# EAGLE design PR5008 (EAGLE 6.6.0)
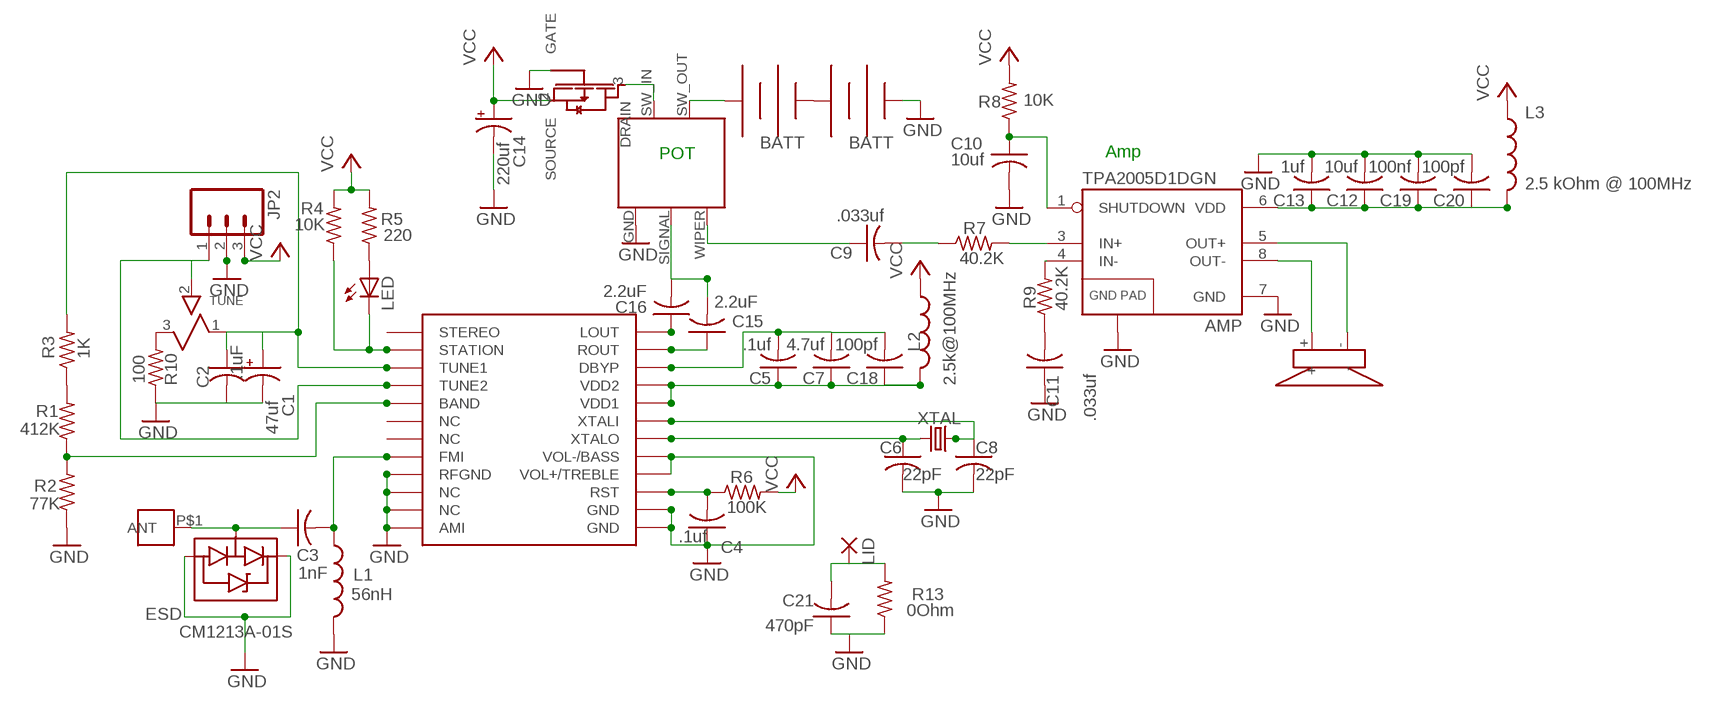
[diagram p0: schematic, sheet 1]

## Parts
AMP  TPA2005D1DGN  [POWER-SOP8]
ANT  M3_SCREW_POST  [M3_SCREW_POST]
C1  47uf  CPOL-USE2-5  [E2-5]
C2  .1uF  C-USC0603  [C0603]
C3  1nF  C-USC0603  [C0603]
C4  .1uf  C-USC0603  [C0603]
C5  .1uf  C-USC0603  [C0603]
C6  22pF  C-USC0603  [C0603]
C7  4.7uf  C-USC0603  [C0603]
C8  22pF  C-USC0603  [C0603]
C9  .033uf  C-USC0603  [C0603]
C10  10uf  C-USC0603  [C0603]
C11  .033uf  C-USC0603  [C0603]
C12  10uf  C-USC0603  [C0603]
C13  1uf  C-USC0603  [C0603]
C14  220uf  CPOL-USE2-5  [E2-5]
C15  2.2uF  C-USC0603  [C0603]
C16  2.2uF  C-USC0603  [C0603]
C18  100pf  C-USC0603  [C0603]
C19  100nf  C-USC0603  [C0603]
C20  100pf  C-USC0603  [C0603]
C21  470pF  C-USC0603  [C0603]
ESD  CM1213A-01S  [SOT23-3]
FET  SI2333DDS  [SI2333DDS]
JP2  M03LOCK  [1X03_LOCK]
L1  56nH  INDUCTOR0603  [0603]
L2  2.5k@100MHz  INDUCTOR0603  [0603]
L3  2.5 kOhm @ 100MHz  INDUCTOR0603  [0603]
LED  LEDCHIPLED_0805  [CHIPLED_0805]
LID  2,54/1,0  [2,54/1,0]
R1  412K  R-US_R0603  [R0603]
R2  77K  R-US_R0603  [R0603]
R3  1K  R-US_R0603  [R0603]
R4  10K  R-US_R0603  [R0603]
R5  220  R-US_R0603  [R0603]
R6  100K  R-US_R0603  [R0603]
R7  40.2K  R-US_R0603  [R0603]
R8  10K  R-US_R0603  [R0603]
R9  40.2K  R-US_R0603  [R0603]
R10  100  R-US_R0603  [R0603]
R13  0Ohm  R-US_R0603  [R0603]
TUNE  10k  64XR_BOURNS_TRIMPOT  [64XR_BOURNS_TRIMPOT]
U$1  BK-92_MPD_AA_BATT_CLIP  [BK-92_MPD_AA_BATT_CLIP]
U$2  BK-92_MPD_AA_BATT_CLIP  [BK-92_MPD_AA_BATT_CLIP]
U$3  CE32A_DAYTON_SPKR  [CE32A_DAYTON_SPKR]
U$4  SI4831_FM_IC  [SI4831_FM_IC]
U$5  RV170SF_TAIWANA_POT_SW  [RV170SF_TAIWANA_POT_SW]
XTAL  CRYSTAL32-SMD  [CRYSTAL-32KHZ-SMD]

## Nets
GND: AMP.7(GND) AMP.9(GND) C1.- C2.2 C4.1 C6.2 C8.2 C10.2 C11.1 C12.2 C13.2 C14.- C19.2 C20.2 C21.1 ESD.2(VP) ESD.3(VN) FET.1(GATE) JP2.2 L1.2 R2.1 R10.1 R13.1 U$2.NEG U$2.NEG@2(NEG) U$4.AMI U$4.GND U$4.GND@2(GND) U$4.NC@3(NC) U$4.NC@4(NC) U$4.RFGND U$4.VOL+/TREBLE U$4.VOL-/BASS U$5.GND
N$1: AMP.3(IN+) R7.2
N$2: AMP.4(IN-) R9.2
N$3: C11.2 R9.1
N$4: C9.2 R7.1
N$5: C15.2 C16.2 U$5.SIGNAL
N$6: C5.2 C7.2 C18.2 U$4.DBYP
N$7: C8.1 U$4.XTALI XTAL.X1
N$8: C4.2 R6.1 U$4.RST
N$9: LED.C R4.1 U$4.STATION
N$10: C6.1 U$4.XTALO XTAL.X2
N$11: LED.A R5.1
N$12: JP2.1 TUNE.2 U$4.TUNE2
N$13: R1.1 R2.2 U$4.BAND
N$14: U$1.NEG U$1.NEG@2(NEG) U$2.POS U$2.POS@2(POS)
N$15: C3.2 L1.1 U$4.FMI
N$16: C5.1 C7.1 C18.1 L2.2 U$4.VDD1 U$4.VDD2
N$17: AMP.6(VDD) C12.1 C13.1 C19.1 C20.1 L3.2
N$18: AMP.1(SHUTDOWN) C10.1 R8.1
N$19: ANT.P$1(ANT) C3.1 ESD.1(CH)
N$20: R1.2 R3.1
N$21: U$1.POS U$1.POS@2(POS) U$5.SW_OUT
N$22: C1.+ C2.1 R3.2 TUNE.1 U$4.TUNE1
N$23: AMP.5(OUT+) U$3.-
N$24: AMP.8(OUT-) U$3.+
N$25: C9.1 U$5.WIPER
N$29: R10.2 TUNE.3
N$30: FET.3(DRAIN) U$5.SW_IN
N$31: C15.1 U$4.ROUT
N$32: C21.2 LID.1(P) R13.2
N$33: C16.1 U$4.LOUT
VCC: C14.+ FET.2(SOURCE) JP2.3 L2.1 L3.1 R4.2 R5.2 R6.2 R8.2
Unconnected: U$4.NC U$4.NC@2(NC) U$4.STEREO

## Notes on the sheet
- POT | Amp

## Library data of the parts
AMP = SparkFun-AnalogIC:TPA2005D1: 1.4W MONO CLASS-D AUDIO POWER AMPLIFIER The TPA2005D1 is a 1.4-W high efficiency filter-free class-D audio power amplifier in a BGA, QFN, or MSOP package that requires only three external components. Datasheet: http://focus.ti.com/lit/ds/symlink/tpa2005d1.pdf 1.4 W Into 8 ? From a 5V Supply at THD = 10% (Typ) Maximum Battery Life and Minimum Heat Efficiency With an 8-? Speaker: 84% at 400 mW, 79% at 100 mW 2.8-mA Quiescent Current 0.5-mA Shutdown Current Ideal for Wireless or Cellular Handsets and PDAs Capable of Driving an 8-? Speaker (2.5 V ? VDD ? 5.5 V) and a 4-? Speaker (2.5 V ? VDD ? 4.2 V) Only Three External Components Optimized PWM Output Stage Eliminates LC Output Filter Internally Generated 250-kHz Switching Frequency Eliminates Capacitor and Resistor Improved PSRR (-71 dB at 217 Hz) and Wide Supply Voltage (2.5 V to 5.5 V) Eliminates Need for a Voltage Regulator Fully Differential Design Reduces RF Rectification and Eliminates Bypass Capacitor Improved CMRR Eliminates Two Input Coupling Capacitors
ANT = PR_Libraries:M3_SCREW_POST
C1 C14 = CPOL-US-LongPads :CPOL-US: POLARIZED CAPACITOR, American symbol
C2-C13 C15 C16 C18-C21 = resistor:C-US: CAPACITOR, American symbol
ESD = PubRadioLib:CM1213A-01S: ESD protection
FET = PubRadioLib:SI2333DDS
JP2 = SparkFun-Connectors:M03: Header 3 Standard 3-pin 0.1" header. Use with straight break away headers (SKU : PRT-00116), right angle break away headers (PRT-00553), swiss pins (PRT-00743), machine pins (PRT-00117), and female headers (PRT-00115). Molex polarized connector foot print use with SKU : PRT-08232 with associated crimp pins and housings.
L1-L3 = SparkFun-Passives:INDUCTOR: Inductors Basic Inductor/Choke - 0603 and 1206. Footprints are not proven and vary greatly between part numbers. SRN6045- 33uH, 20% 1.4A SDR0403-560KL - 56uH, 10%, 500mA RMS/740mA peak
LED = led:LED: LED OSRAM: - CHIPLED LG R971, LG N971, LY N971, LG Q971, LY Q971, LO R971, LY R971 LH N974, LH R974 LS Q976, LO Q976, LY Q976 LO Q996 - Hyper CHIPLED LW Q18S LB Q993, LB Q99A, LB R99A - SideLED LS A670, LO A670, LY A670, LG A670, LP A670 LB A673, LV A673, LT A673, LW A673 LH A674 LY A675 LS A676, LA A676, LO A676, LY A676, LW A676 LS A679, LY A679, LG A679 - Hyper Micro SIDELED® LS Y876, LA Y876, LO Y876, LY Y876 LT Y87S - SmartLED LW L88C, LW L88S LB L89C, LB L89S, LG L890 LS L89K, LO L89K, LY L89K LS L896, LA L896, LO L896, LY L896 - TOPLED LS T670, LO T670, LY T670, LG T670, LP T670 LSG T670, LSP T670, LSY T670, LOP T670, LYG T670 LG T671, LOG T671, LSG T671 LB T673, LV T673, LT T673, LW T673 LH T674 LS T676, LA T676, LO T676, LY T676, LB T676, LH T676, LSB T676, LW T676 LB T67C, LV T67C, LT T67C, LS T67K, LO T67K, LY T67K, LW E67C LS E67B, LA E67B, LO E67B, LY E67B, LB E67C, LV E67C, LT E67C LW T67C LS T679, LY T679, LG T679 LS T770, LO T770, LY T770, LG T770, LP T770 LB T773, LV T773, LT T773, LW T773 LH T774 LS E675, LA E675, LY E675, LS T675 LS T776, LA T776, LO T776, LY T776, LB T776 LHGB T686 LT T68C, LB T68C - Hyper Mini TOPLED® LB M676 - Mini TOPLED Santana® LG M470 LS M47K, LO M47K, LY M47K Source: http://www.osram.convergy.de LUXEON: - LUMILED® LXK2-PW12-R00, LXK2-PW12-S00, LXK2-PW14-U00, LXK2-PW14-V00 LXK2-PM12-R00, LXK2-PM12-S00, LXK2-PM14-U00 LXK2-PE12-Q00, LXK2-PE12-R00, LXK2-PE12-S00, LXK2-PE14-T00, LXK2-PE14-U00 LXK2-PB12-K00, LXK2-PB12-L00, LXK2-PB12-M00, LXK2-PB14-N00, LXK2-PB14-P00, LXK2-PB14-Q00 LXK2-PR12-L00, LXK2-PR12-M00, LXK2-PR14-Q00, LXK2-PR14-R00 LXK2-PD12-Q00, LXK2-PD12-R00, LXK2-PD12-S00 LXK2-PH12-R00, LXK2-PH12-S00 LXK2-PL12-P00, LXK2-PL12-Q00, LXK2-PL12-R00 Source: www.luxeon.com KINGBRIGHT: KA-3528ASYC Source: www.kingbright.com
LID = wirepad:2,54/1,0: THROUGH-HOLE PAD
R1-R10 R13 = resistor:R-US_: RESISTOR, American symbol
TUNE = PR_Libraries:64XR_BOURNS_TRIMPOT: This is a bourns trimpot
U$1 U$2 = PR_Libraries:BK-92_MPD_AA_BATT_CLIP
U$3 = PR_Libraries:CE32A_DAYTON_SPKR
U$4 = PR_Libraries:SI4831_FM_IC
U$5 = PR_Libraries:RV170SF_TAIWANA_POT_SW
XTAL = SparkFun-FreqCtrl:CRYSTAL: Various standard crystals. Proven footprints. Spark Fun Electronics SKU : COM-00534; PROD_ID: XTAL-07894

## Board
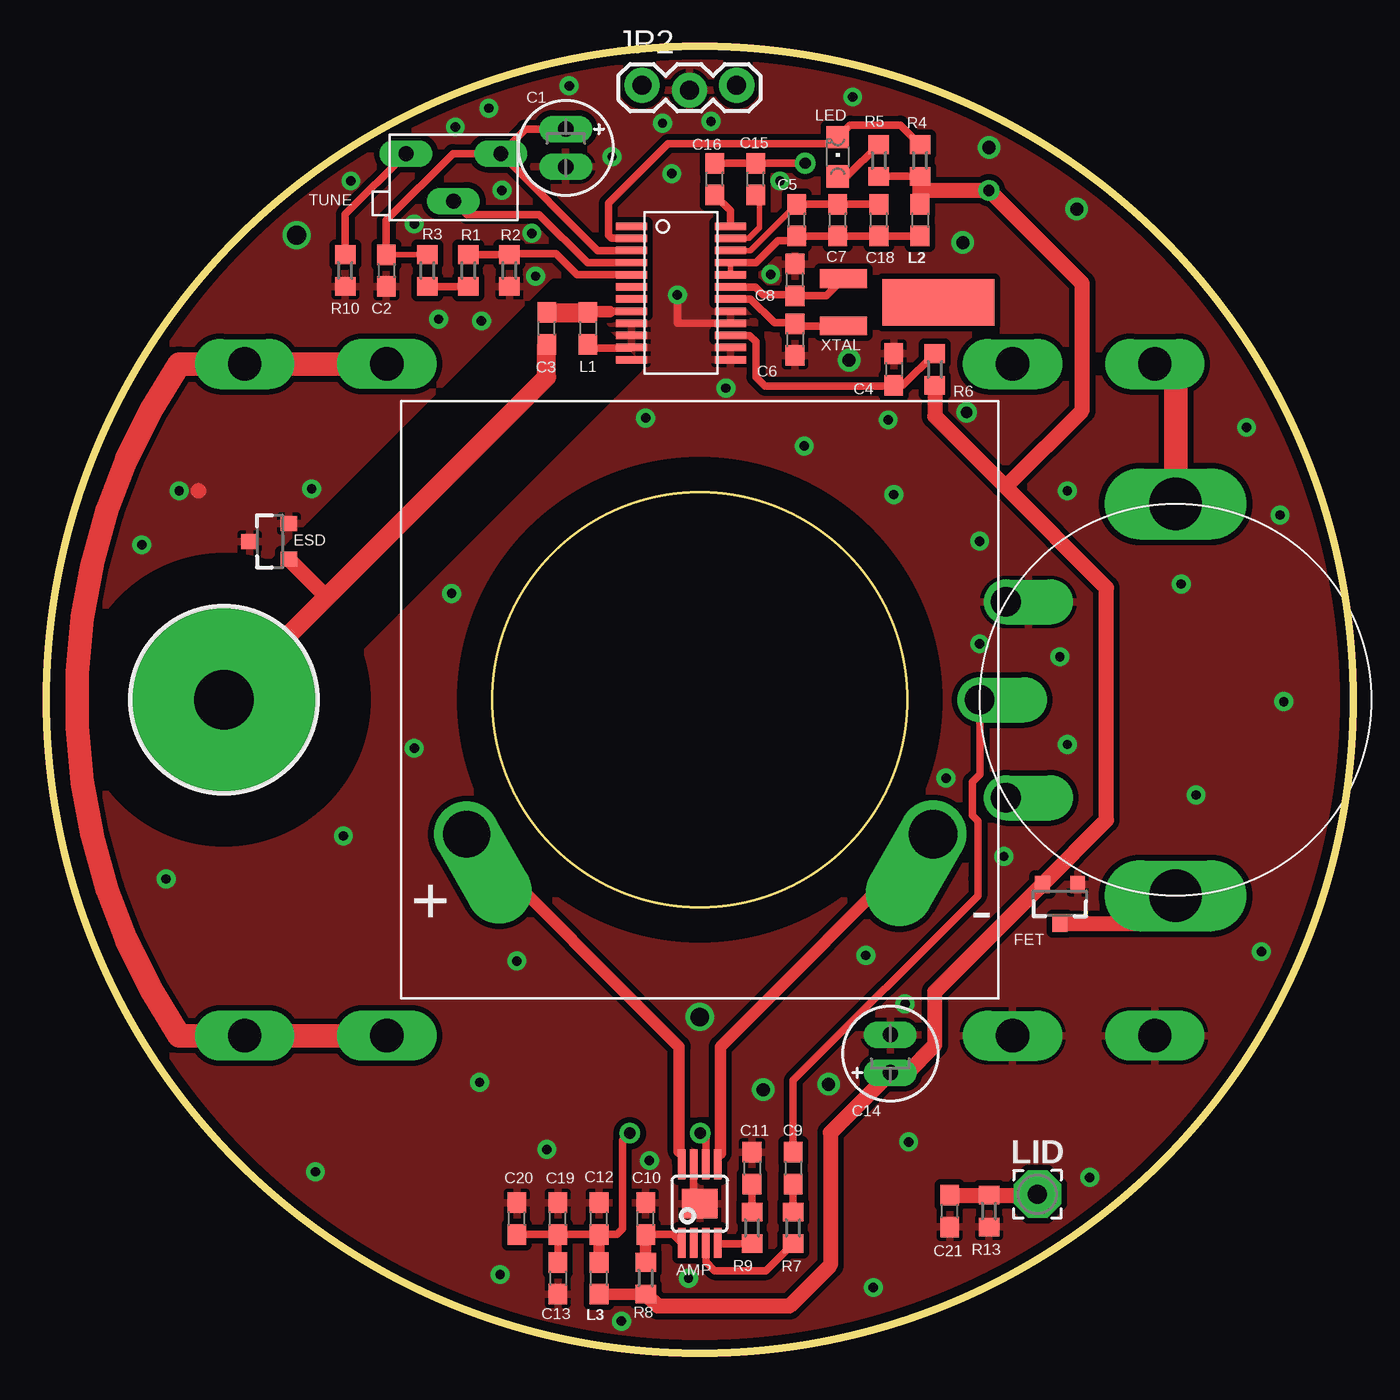
[diagram p1: board, top side]
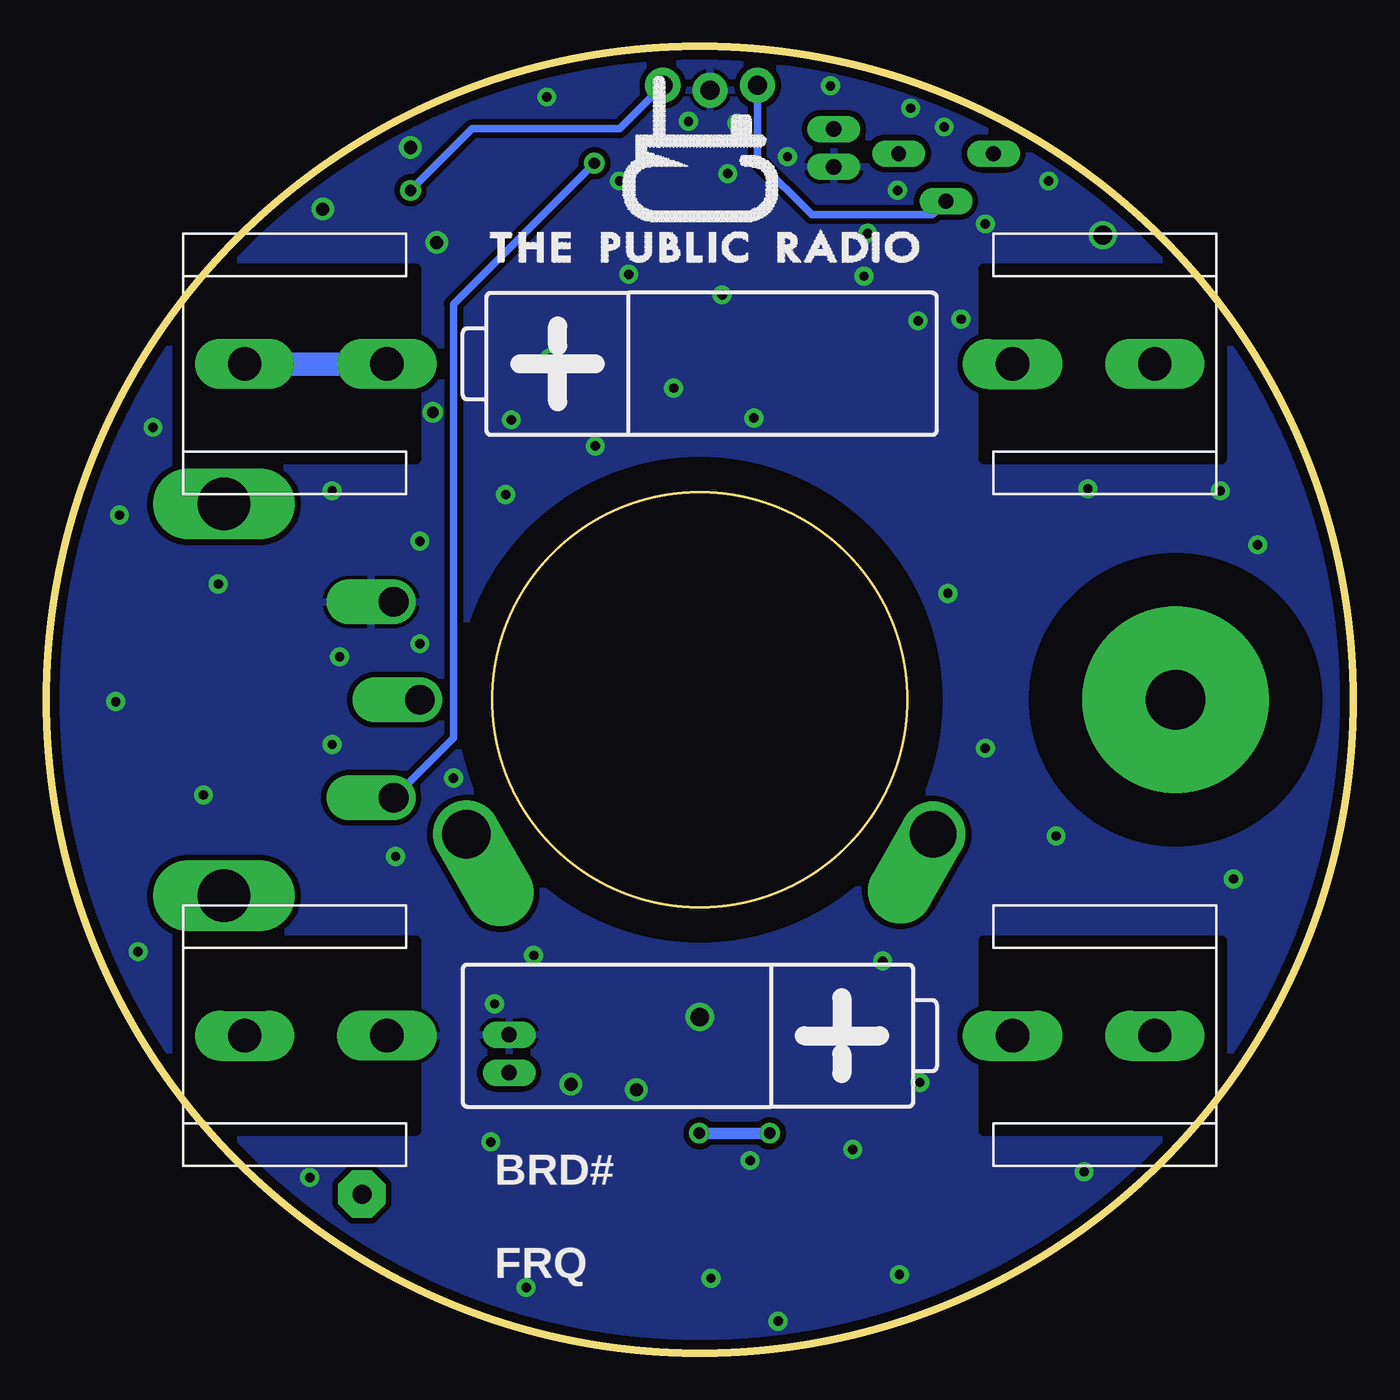
[diagram p2: board, bottom side, seen from below]

Size 70 x 70 mm. Coordinates in mm from the lower left corner, seen from the top.
Outline: circle at 35,35 radius 35
Copper layers (1*16): Top 0.035mm / dielectric 1.5mm / Bottom 0.035mm
Design rules "PCBCart-Standard *": minimum track width 8mil, minimum drill 0.4mm, track to track 8mil, track to pad 8mil, pad to pad 8mil, via to via 8mil, smd to smd 8mil, copper to edge 20mil, drill to drill 8mil, minimum pad ring 8mil, minimum via ring 10mil, stop-mask expansion 3mil, vias tented up to drill 0mil, thermal gap 8mil
tRestrict: area 22.5,22.5 to 47.5,47.5; area 5.2,30.8 to 31.7,57.3
bRestrict: area 22.5,22.5 to 47.5,47.5

### Footprints (pad centres in the part's own frame; a part is rotated, then mirrored left to right if it is on the bottom)
POWER-SOP8 = smd 0.4 x 1.6: 1 -0.975,-2.1; 2 -0.325,-2.1; 3 0.325,-2.1; 4 0.975,-2.1; 5 0.975,2.1; 6 0.325,2.1; 7 -0.325,2.1; 8 -0.975,2.1 | smd 1.89 x 1.57: 9 0,0
M3_SCREW_POST = drill 3.2 pad 10: P$1 0,0
E2-5 = drill 0.813 pad 1.422 long: + -1.016,0; - 1.016,0
C0603 = smd 1.1 x 1: 1 -0.85,0; 2 0.85,0
SOT23-3 = smd 0.8 x 0.9: 1 -0.95,-1; 2 0.95,-1; 3 0,1.1
SI2333DDS = smd 0.8 x 0.9: 1 -0.95,-1; 2 0.95,-1; 3 0,1.1
1X03_LOCK = drill 1.016 pad 1.88: 1 0,0.127; 2 2.54,-0.127; 3 5.08,0.127
0603 = smd 1.1 x 1: 1 -0.85,0; 2 0.85,0
CHIPLED_0805 = smd 1.2 x 1.2: A 0,-1.05; C 0,1.05
2,54/1,0 = drill 1.016 pad 2.54 octagon: 1 0,0
R0603 = smd 1 x 1.1: 1 -0.85,0; 2 0.85,0
64XR_BOURNS_TRIMPOT = drill 0.8 pad 1.422 long: 1 2.54,1.27; 2 0,-1.27; 3 -2.54,1.27
BK-92_MPD_AA_BATT_CLIP = drill 1.778 long: NEG -24.384,0; NEG@2 -16.764,0; POS 16.764,0; POS@2 24.384,0
CE32A_DAYTON_SPKR = drill 2.5 offset: + -12.5,-7.2 | drill 2.6 offset: - 12.5,-7.2
SI4831_FM_IC = smd 1.65 x 0.4: AMI -2.65,-3.575; BAND -2.65,0.975; DBYP 2.65,2.275; FMI -2.65,-0.975; GND 2.65,-2.925; GND@2 2.65,-3.575; LOUT 2.65,3.575; NC -2.65,0.325; NC@2 -2.65,-0.325; NC@3 -2.65,-2.275; NC@4 -2.65,-2.925; RFGND -2.65,-1.625; ROUT 2.65,2.925; RST 2.65,-2.275; STATION -2.65,2.925; STEREO -2.65,3.575; TUNE1 -2.65,2.275; TUNE2 -2.65,1.625; VDD1 2.65,0.975; VDD2 2.65,1.625; VOL+/TREBLE 2.65,-1.625; VOL-/BASS 2.65,-0.975; XTALI 2.65,0.325; XTALO 2.65,-0.325
RV170SF_TAIWANA_POT_SW = drill 1.6 offset: GND -5.25,-9.09; SIGNAL 5.25,-9.09; WIPER 0,-10.5 | drill 2.8 long: SW_IN 10.5,0; SW_OUT -10.5,0
CRYSTAL-32KHZ-SMD = smd 2.5 x 6: SHEILD 0,5.08 | smd 1 x 2.5: X1 -1.27,0; X2 1.27,0

### Placement (x,y rotation side)
AMP  35,8 0 top
ANT  9.5,35 0 top
C1  27.82,64.57 270 top
C2  18.2,58 270 top
C3  26.8,54.9 90 top
C4  45.4,52.7 270 top
C5  40.2,60.7 90 top
C6  40.1,54.3 270 top
C7  42.4,60.7 90 top
C8  40.1,57.5 90 top
C9  40,9.9 270 top
C10  32.1,7.2 90 top
C11  37.8,9.9 270 top
C12  29.6,7.2 90 top
C13  27.4,4 270 top
C14  45.22,16.03 90 top
C15  38,62.9 90 top
C16  35.8,62.9 90 top
C18  44.6,60.7 90 top
C19  27.4,7.2 90 top
C20  25.2,7.2 90 top
C21  48.4,7.6 90 top
ESD  11.98,43.49 90 top
FET  54.3,24.1 180 top
JP2  31.9,67.8 0 top
L1  29,54.9 270 top
L2  46.8,60.7 270 top
L3  29.6,4 90 top
LED  42.4,64.1 0 top
LID  53.1,8.5 0 top
R1  22.6,58 270 top
R2  24.8,58 90 top
R3  20.4,58 90 top
R4  46.8,63.9 270 top
R5  44.6,63.9 270 top
R6  47.6,52.7 270 top
R7  40,6.7 270 top
R8  32.1,4 270 top
R9  37.8,6.7 270 top
R10  16,58 90 top
R13  50.5,7.6 90 top
TUNE  21.8,63 0 top
U$1  35,53 180 bottom
U$2  35,17 0 bottom
U$3  35,35 0 top
U$4  34,56.8 0 top
U$5  60.5,35 270 top
XTAL  42.7,56.3 270 top

### Tracks (layer width: path | path; a pad name or v marks a point on that pad's centre or on a via)
GND  (via drill 0.5, 0.6, 0.7, 1)
  Top 0.406: L1.2 29.2,53.85 31.33,53.85 U$4.NC@4 | AMP.7 34.67,8.32 AMP.9 | U$4.VOL+/TREBLE 33.8,55.17 v33.8,56.7
  Top 0.813: 8.17,46.2 8.1,46.2
  other vias: 43,53.2 55.2,61.3 23.3,55.3 13.4,59.9 35,18 30.3,64.1 33,65.9 33.5,63.2 21.9,65.7 24.4,62.3 28,67.9 49.1,59.5 38.8,57.8 49.3,50.4 39.3,62.8 35.6,66 43.2,67.3 23.7,66.7 34.4,4 38.4,14.1 41.9,14.4 32.1,50.1 45.1,50 54.7,46.2 64.3,49.6 66.3,34.9 54.3,37.3 54.7,32.6 50,43.5 51.3,26.6 43.9,21.3 25.2,21 30.8,1.7 24.3,4.2 26.8,10.9 46.2,11.3 55.9,9.4 65.1,21.5 14.4,9.7 6.4,25.4 19.7,32.4 5.1,43.3 14.2,46.3 21,55.4 48.2,30.8 46,18.7 32.3,10.3 23.2,14.5 15.9,27.7 7.1,46.2 21.7,40.7 40.6,48.6 45.4,46 50,38 60.8,41.2 61.6,29.9 44.3,3.5 66.1,44.9 16.3,62.8 36.4,51.7 50.5,64.6 26.2,57.7 26,60 19.7,60.5
  pour Top (isolate 0.305): 35,70 arc-90 70,35 arc-90 35,0 arc-90 0,35 arc-90
  pour Bottom (isolate 0.305): 35,70 arc-90 70,35 arc-90 35,0 arc-90 0,35 arc-90
N$1
  Top 0.406: AMP.3 35.33,4.88 35.8,4.4 38.55,4.4 R7.2
N$2
  Top 0.305: 36.02,5.85 AMP.4
  Top 0.406: 35.98,5.85 AMP.4 | R9.2 36.02,5.85
N$3
  Top 0.406: R9.1 C11.2
N$4
  Top 0.406: C9.2 R7.1
N$5  (via drill 0.6)
  Top 0.406: C16.2 C15.2 v40.65,63.75
  Bottom 0.406: U$5.SIGNAL 48.2,32.96 48.2,56.2 v40.65,63.75
N$6
  Top 0.305: 40.15,61.55 C5.2 37.73,59.08 U$4.DBYP
  Top 0.406: C18.2 C7.2 C5.2
N$7
  Top 0.305: 40.05,56.7 C8.1
  Top 0.406: C8.1 41.78,56.65 XTAL.X1 | U$4.XTALI 37.98,57.12 38.4,56.7 40.05,56.7
N$8
  Top 0.305: 45.35,51.8 C4.2
  Top 0.406: 45.35,51.8 38.5,51.8 38,52.3 38,54.2 37.67,54.52 U$4.RST | C4.2 45.9,51.85 R6.1
N$9
  Top 0.305: 42.05,64.8 LED.C
  Top 0.406: U$4.STATION 30.27,59.73 30.1,59.9 30.1,61.6 33.3,64.8 42.05,64.8 | LED.C 43.05,65.8 45.75,65.8 R4.1
N$10
  Top 0.305: 40.32,55.03 C6.1 40.05,55.2
  Top 0.406: 40.32,55.03 XTAL.X2 | U$4.XTALO 37.73,56.48 39,55.2 40.05,55.2
N$11
  Top 0.305: LED.A 42.9,63.05
  Top 0.406: 42.9,63.05 R5.1
N$12
  Top 0.406: U$4.TUNE2 28.98,58.42 26.4,61 22.53,61 TUNE.2
  Bottom 0.406: JP2.1 31.9,63.9 29,61 22.53,61 TUNE.2
N$13
  Top 0.406: R1.1 R2.2 24.85,58.9 27.3,58.9 28.43,57.77 U$4.BAND
N$14
  Top 1.27: U$2.POS U$2.POS@2 7.1,17 arc-68 7.1,53 U$1.NEG U$1.NEG@2
N$15
  Top 0.406: U$4.FMI 30.23,55.83 30.2,55.8
  Top 0.61: 30.2,55.8 29.05,55.8 L1.1
  Top 1.016: C3.2 L1.1
N$16
  Top 0.305: U$4.VDD1 U$4.VDD2 | 39.95,59.6 C5.1
  Top 0.406: L2.2 C18.1 C7.1 C5.1 | U$4.VDD2 38.02,58.42 39.2,59.6 39.95,59.6
N$17  (via drill 0.6)
  Top 0.406: v35.02,11.78 35.33,11.47 AMP.6 | v31.25,11.78 30.87,11.39 30.87,6.66 30.57,6.36 C12.1 C19.1 | C19.1 C20.1 | C19.1 C13.1
  Top 0.61: L3.2 C12.1
  Bottom 0.61: v31.25,11.78 v35.02,11.78
N$18
  Top 0.406: C10.1 33.58,6.35 AMP.1
  Top 0.61: R8.1 C10.1
N$19
  Top 0.813: ESD.1 14.93,40.59 15.09,40.59
  Top 1.016: ANT.P$1 15.09,40.59 26.8,52.3 C3.1
N$20
  Top 0.406: R3.1 R1.2
N$21
  Top 1.27: U$1.POS@2 60.5,51.88 U$5.SW_OUT
  Bottom 1.27: U$1.POS U$1.POS@2
N$22
  Top 0.305: 24.27,64.2 TUNE.1 | C2.1 R3.2
  Top 0.406: TUNE.1 25.66,65.59 C1.+ | U$4.TUNE1 29.54,59.08 TUNE.1 | TUNE.1 21.77,64.27 18.2,60.7 C2.1
N$23
  Top 0.406: AMP.5 35.98,10.57 36.1,10.7
  Top 0.61: U$3.- 36.1,16.4 36.1,10.7
N$24
  Top 0.406: AMP.8 34.02,10.68 33.9,10.8
  Top 0.61: 33.9,10.8 33.9,16.4 U$3.+
N$25
  Top 0.406: U$5.WIPER 50,31 49.6,30.6 49.6,28.8 49.9,28.5 49.9,25.4 49.9,24.5 40,14.6 C9.1
N$29
  Top 0.406: TUNE.3 16,61.01 R10.2
N$30
  Top 0.813: U$5.SW_IN 59,23 FET.3
N$31
  Top 0.305: 38.1,61.95 C15.1 38.2,61.85 38.2,60.3 37.62,59.73 U$4.ROUT
N$32
  Top 0.813: C21.2 R13.2 53.1,8.45 LID.1
N$33
  Top 0.406: U$4.LOUT 36.65,61.2 C16.1
VCC  (via drill 0.6)
  Top 0.406: R5.2 R4.2
  Top 0.61: L3.1 R8.2
  Top 0.813: 32.25,3.24 R8.2 32.75,2.5 39.8,2.5 42,4.7 42,11.8 C14.+ 46.12,15.02 47.6,16.5 47.6,19.35 FET.2 56.8,28.55 56.8,41 51.25,46.55 | L2.1 46.8,62.3 | 46.8,62.3 v50.5,62.3 55.5,57.3 55.5,50.5 51.55,46.55 51.25,46.55 | 46.8,62.3 R4.2 | R6.2 47.6,50.2 51.25,46.55
  Bottom 0.406: JP2.3 39.31,65.6 47.2,65.6 v50.5,62.3

### Text on the board
bPlace: BRD# | FRQ
tNames: TUNE | L1